# Altium project Common_Sensor_Box.PrjPCB (part 16 of 17)

## Sheet Sensor_LoRa_Flower_Watchdog.SchDoc: Title
size 420 x 297 mm; Author: G.Kasprowicz; CompanyName: WUT ISE; DrawnBy: G.Kasprowicz; Organization: WUT ISE; Address1: PW ISE; Address2: Nowowiejska 15/19 00-665 Warsaw; Address3: gkasprow@gmail.com; Revision: 1.0; SheetNumber: -; SheetTotal: -; ModifiedBy: -; CheckedDate: -; Title2: Title2; DivGrp: WUT ISE; Designer: G.Kasprowicz; ModifiedDate: -; ProjectName: Sensor Box
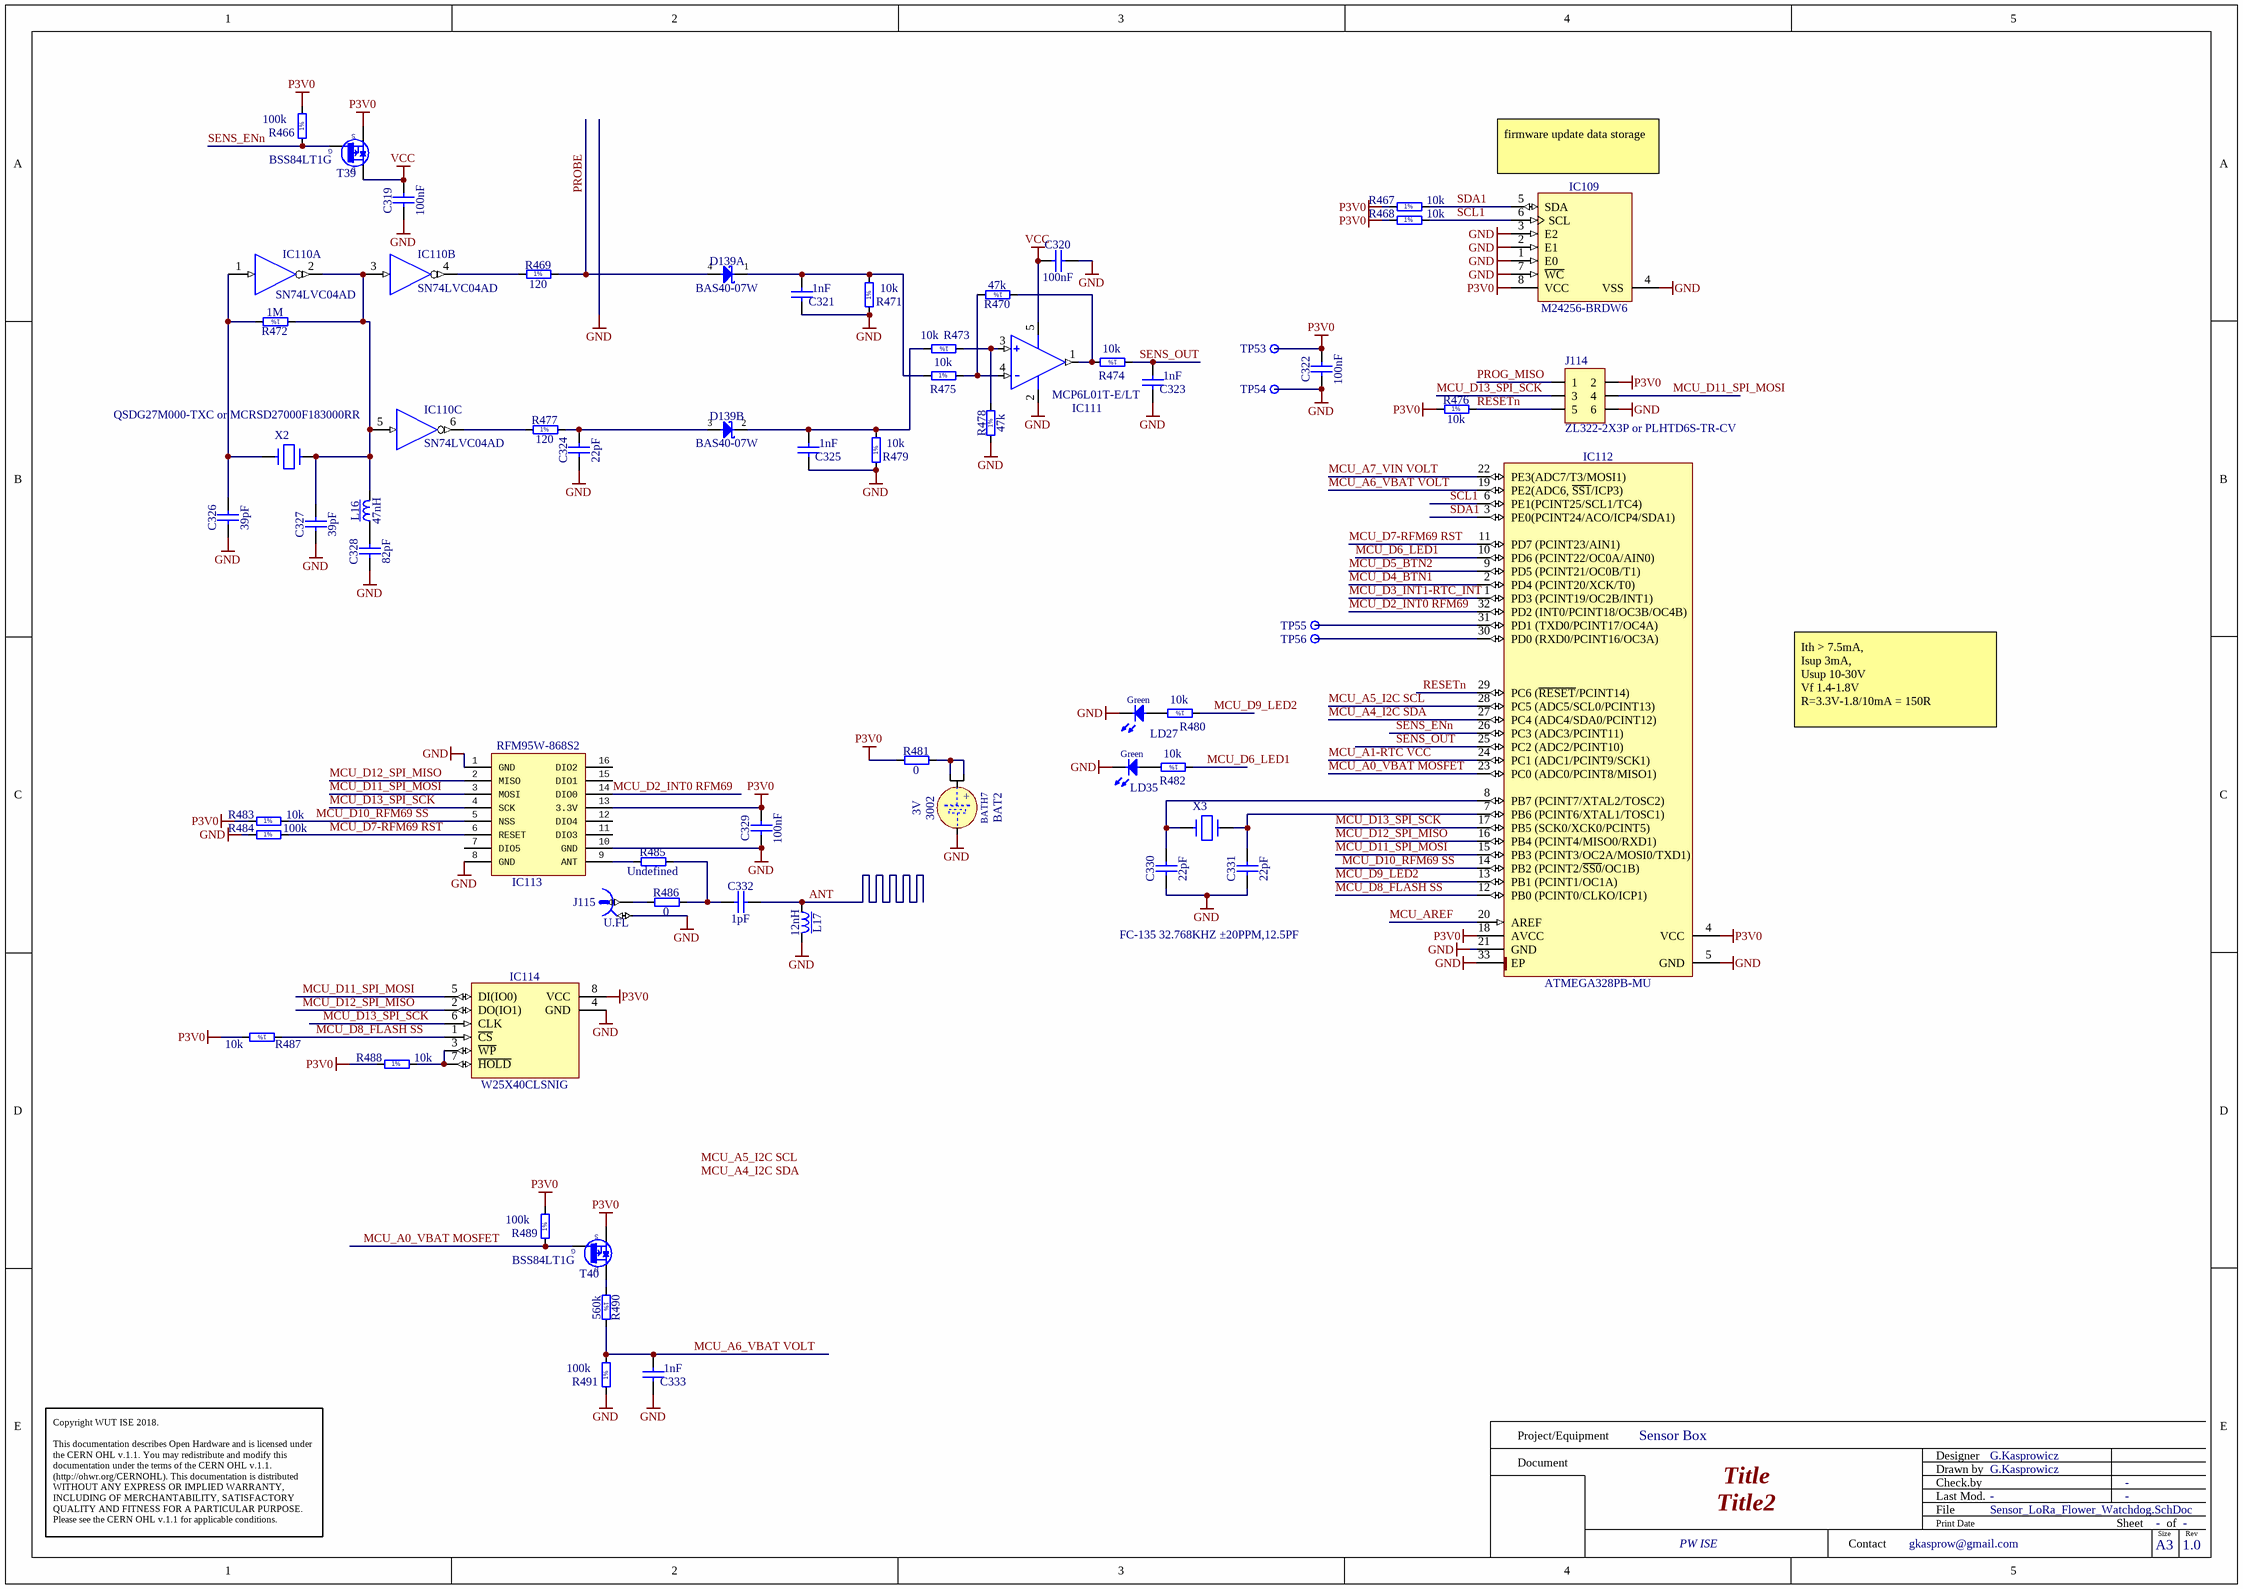
[diagram p22: Sensor_LoRa_Flower_Watchdog.SchDoc]

### Parts
(Parts that share a designator on the sheet are numbered #1, #2 ... from top to bottom, then left to right.)
BAT2  3V  [BAT_VARTA_CR2032]
BATH7  3002  [KEYSTONE 3002]
C319  100nF  [CAPC1005X55N]
C320  100nF  [CAPC1005X55N]
C321  1nF  [CAPC1005X55N]
C322  100nF  [CAPC1005X55N]
C323  1nF  [CAPC1005X55N]
C324  22pF  [CAPC1005X55N]
C325  1nF  [CAPC1005X55N]
C326  39pF  [CAPC1608X87N]
C327  39pF  [CAPC1608X87N]
C328  82pF  [CAPC2012X90N]
C329  100nF  [CAPC1005X55N]
C330  22pF  [CAPC1005X55N]
C331  22pF  [CAPC1005X55N]
C332  1pF  [CAPC1005X55N]
C333  1nF  [CAPC1005X55N]
D139  BAS40-07W  [INFINEON-PG-SOT343-4]  (parts A,B of 2)
IC109  M24256-BRDW6  [SOP65P640X120-8N]
IC110  SN74LVC04AD  [SOIC127P600X175-14N]  (parts A,B,C of 6)
IC111  MCP6L01T-E/LT  [SC70]
IC112  ATMEGA328PB-MU  [QFN50P500X500X100-33N-S325]
IC113  RFM95W-868S2  [RFM95W]
IC114  W25X40CLSNIG  [SOIC127P600X135-8N]
J114  ZL322-2X3P or PLHTD6S-TR-CV  [ZL322-2X3P]
J115  U.FL  [HIROSE_U.FL-R-SMT-1(10)]
L16  47nH  [IND_COILCRAFT_0805CS]
L17  12nH  [IND_COILCRAFT_0603HP]
LD27  Green  [LED_KINGBRIGHT_KPH-1608CGCK]
LD35  Green  [LED_KINGBRIGHT_KPH-1608CGCK]
R466  100k  [RESC1005X40N]
R467  10k  [RESC1005X40N]
R468  10k  [RESC1005X40N]
R469  120  [RESC1005X40N]
R470  47k  [RESC1005X40N]
R471  10k  [RESC1005X40N]
R472  1M  [RESC1005X40N]
R473  10k  [RESC1005X40N]
R474  10k  [RESC1005X40N]
R475  10k  [RESC1005X40N]
R476  10k  [RESC1005X40N]
R477  120  [RESC1005X40N]
R478  47k  [RESC1005X40N]
R479  10k  [RESC1005X40N]
R480  10k  [RESC1005X40N]
R481  0  [RESC1608X55N]
R482  10k  [RESC1005X40N]
R483  10k  [RESC1005X40N]
R484  100k  [RESC1005X40N]
R485  Undefined  [RESC1608X55N]
R486  0  [RESC1608X55N]
R487  10k  [RESC1005X40N]
R488  10k  [RESC1005X40N]
R489  100k  [RESC1005X40N]
R490  560k  [RESC1005X40N]
R491  100k  [RESC1005X40N]
T39  BSS84LT1G  [SOT95P240X110-3N]
T40  BSS84LT1G  [SOT95P240X110-3N]
TP53  Test Point  [TPS127]  (value not drawn)
TP54  Test Point  [TPS127]  (value not drawn)
TP55  Test Point  [TPS127]  (value not drawn)
TP56  Test Point  [TPS127]  (value not drawn)
X2#2  QSDG27M000-TXC or MCRSD27000F183000RR  [HC-49SM]
X3#2  FC-135 32.768KHZ ±20PPM,12.5PF  [XTAL_FC135]

### Nets
GND: BATH7.2(MINUS) C319.1 C320.2 C321.1 C322.1 C323.1 C324.1 C325.1 C326.1 C327.1 C328.1 C329.1 C330.1 C331.1 C333.1 IC109.1(E0) IC109.2(E1) IC109.3(E2) IC109.4(VSS) IC109.7(~{WC}) IC110.7(GND) IC111.2(V-) IC112.5(GND) IC112.21(GND) IC112.33(EP) IC113.1(GND) IC113.8(GND) IC113.10(GND) IC114.4(GND) J114.6 J115.2 L17.2 LD27.1(C) LD35.1(C) R471.1 R478.1 R479.1 R484.1 R491.1 TP54.1
P3V0: C322.2 C329.2 IC109.8(VCC) IC112.4(VCC) IC112.18(AVCC) IC113.13(3.3V) IC114.8(VCC) J114.2 R466.2 R467.1 R468.1 R476.1 R481.1 R483.1 R487.2 R488.1 R489.2 T39.2(S) T40.2(S) TP53.1
VCC: C319.2 C320.1 IC110.14(VCC) IC111.5(V+) T39.3(D)
ANT: C332.2 L17.1
MCU_A0_VBAT MOSFET: IC112.23(PC0_(ADC0/PCINT8/MISO1)) R489.1 T40.1(G)
MCU_A1-RTC VCC: IC112.24(PC1_(ADC1/PCINT9/SCK1))
MCU_A4_I2C SDA: IC112.27(PC4_(ADC4/SDA0/PCINT12))
MCU_A5_I2C SCL: IC112.28(PC5_(ADC5/SCL0/PCINT13))
MCU_A6_VBAT VOLT: C333.2 IC112.19(PE2(ADC6,_~{SS1}/ICP3)) R490.2 R491.2
MCU_A7_VIN VOLT: IC112.22(PE3(ADC7/T3/MOSI1))
MCU_AREF: IC112.20(AREF)
MCU_D2_INT0 RFM69: IC112.32(PD2_(INT0/PCINT18/OC3B/OC4B)) IC113.14(DIO0)
MCU_D3_INT1-RTC_INT: IC112.1(PD3_(PCINT19/OC2B/INT1))
MCU_D4_BTN1: IC112.2(PD4_(PCINT20/XCK/T0))
MCU_D5_BTN2: IC112.9(PD5_(PCINT21/OC0B/T1))
MCU_D6_LED1: IC112.10(PD6_(PCINT22/OC0A/AIN0)) R482.1
MCU_D7-RFM69 RST: IC112.11(PD7_(PCINT23/AIN1)) IC113.6(RESET) R484.2
MCU_D8_FLASH SS: IC112.12(PB0_(PCINT0/CLKO/ICP1)) IC114.1(~{CS}) R487.1
MCU_D9_LED2: IC112.13(PB1_(PCINT1/OC1A)) R480.1
MCU_D10_RFM69 SS: IC112.14(PB2_(PCINT2/~{SS0}/OC1B)) IC113.5(NSS) R483.2
MCU_D11_SPI_MOSI: IC112.15(PB3_(PCINT3/OC2A/MOSI0/TXD1)) IC113.3(MOSI) IC114.5(DI(IO0)) J114.4
MCU_D12_SPI_MISO: IC112.16(PB4_(PCINT4/MISO0/RXD1)) IC113.2(MISO) IC114.2(DO(IO1))
MCU_D13_SPI_SCK: IC112.17(PB5_(SCK0/XCK0/PCINT5)) IC113.4(SCK) IC114.6(CLK) J114.3
PROBE: D139.4(A) R469.2
PROG_MISO: J114.1
RESETn: IC112.29(PC6_(~{RESET}/PCINT14)) J114.5 R476.2
SCL1: IC109.6(SCL) IC112.6(PE1(PCINT25/SCL1/TC4)) R468.2
SDA1: IC109.5(SDA) IC112.3(PE0(PCINT24/ACO/ICP4/SDA1)) R467.2
SENS_ENn: IC112.26(PC3_(ADC3/PCINT11)) R466.1 T39.1(G)
SENS_OUT: C323.2 IC112.25(PC2_(ADC2/PCINT10)) R474.1
NetBATH7_1a: BATH7.1a(PLUS) BATH7.1b(PLUS) R481.2
NetC321_2: C321.2 D139.1(C) R471.2 R475.1
NetC324_2: C324.2 D139.3(C) R477.2
NetC325_2: C325.2 D139.2(A) R473.2 R479.2
NetC326_2: C326.2 IC110.1(A) R472.2 X2#2.1
NetC327_2: C327.2 IC110.2(~{O}) IC110.3(A) IC110.5(A) L16.2 R472.1 X2#2.2
NetC328_2: C328.2 L16.1
NetC330_2: C330.2 IC112.8(PB7_(PCINT7/XTAL2/TOSC2)) X3#2.1
NetC331_2: C331.2 IC112.7(PB6_(PCINT6/XTAL1/TOSC1)) X3#2.2
NetC332_1: C332.1 R485.2 R486.2
NetIC110_4: IC110.4(~{O}) R469.1
NetIC110_6: IC110.6(~{O}) R477.1
NetIC111_1: IC111.1(OUT) R470.1 R474.2
NetIC111_3: IC111.3(IN+) R473.1 R478.2
NetIC111_4: IC111.4(in-) R470.2 R475.2
NetIC112_30: IC112.30(PD0_(RXD0/PCINT16/OC3A)) TP56.1
NetIC112_31: IC112.31(PD1_(TXD0/PCINT17/OC4A)) TP55.1
NetIC113_9: IC113.9(ANT) R485.1
NetIC114_3: IC114.3(~{WP}) IC114.7(~{HOLD}) R488.2
NetJ115_1: J115.1 R486.1
NetLD27_2: LD27.2(A) R480.2
NetLD35_2: LD35.2(A) R482.2
NetR490_1: R490.1 T40.3(D)

Not connected (* = marked no-connect by the designer): IC113 7(DIO5) 11(DIO3) 12(DIO4) 15(DIO1) 16(DIO2)

### Notes on the sheet
- (near IC109) firmware update data storage
- Ith > 7.5mA,
  Isup 3mA,
  Usup 10-30V
  Vf 1.4-1.8V
  R=3.3V-1.8/10mA = 150R
- Labels drawn without touching a wire or pin: MCU_A4_I2C SDA, MCU_A5_I2C SCL
- Project/Equipment
- Document
- Designer
- Drawn by
- Check.by
- Copyright WUT ISE 2018.
  This documentation describes Open Hardware and is licensed under the CERN OHL v.1.1. You may redistribute and modify this documentation under the terms of the CERN OHL v.1.1. (http://ohwr.org/CERNOHL). This documentation is distributed WITHOUT ANY EXPRESS OR IMPLIED WARRANTY, INCLUDING OF MERCHANTABILITY, SATISFACTORY QUALITY AND FITNESS FOR A PARTICULAR PURPOSE. Please see the CERN OHL v.1.1 for applicable conditions.
- Contact
- File
- Last Mod.
- Print Date
- Sheet
- Size
- A3
- of
- Rev
- (in symbol BAT_VARTA_CR2032) +
- (in symbol BATTERY_HOLD_CR2032_SMD) +
- (in symbol R0402_1M_1%_0.0625W_100PPM) 1%
- (in symbol R0402_10K_1%_0.0625W_100PPM) 1%
- (in symbol R0402_47K_1%_0.0625W_100PPM) 1%
- (in symbol R0402_100K_1%_0.0625W_100PPM) 1%
- (in symbol R0402_120R_1%_0.0625W_100PPM) 1%
- (in symbol R0402_560K_1%_0.0625W_100PPM) 1%

### Library data of the parts
BAT2 = BAT_VARTA_CR2032: Battery for use only with Socket Holder; Part Description: 20x3.2mm Lithium Coin Cells Type CR2032; Manufacturer: VARTA; Manufacturer Part Number: 6032101501; PressFit: No; Power: 230mAh; Part Number: BAT_VARTA_CR2032; Component Kind: Standard; Component Type: Standard; Pin Count: 0; PackageDescription: CR2032, 20mm Diameter x 3.2mm  Height Lithium Coin Cells; Family: Battery; Mounted: Yes; Socket: Yes; SMD: No; Sense: No; Value: 3V; ComponentHeight: 3.2mm; HelpURL: \\cern.ch\dfs\Applications\Altium\Datasheets\BAT_VARTA_CR2032.pdf; Author: CERN DEM JLC; CreateDate: 20/10/2009; LatestRevisionDate: 20/10/2009
BATH7 = BATTERY_HOLD_CR2032_SMD: Battery Holder Keystone 3002; Part Number: BATH_KEYSTONE_3000; Part Description: KEYSTONE 3002 CR2032 BATTERY HOLDER; PressFit: No; Component Kind: Standard; Component Type: Standard; Pin Count: 3; PackageDescription: KEYSTONE 3002 CR2032 BATTERY HOLDER; Family: Battery; Mounted: Yes; Socket: No; SMD: Yes; Sense: No; Manufacturer: KEYSTONE; Manufacturer Part Number: 3002; ComponentHeight: 3.17mm; HelpURL: \\cern.ch\dfs\Applications\Altium\Datasheets\BATH_KEYSTONE_3000.pdf; Author: GK; CreateDate: 17/04/2012; LatestRevisionDate: 07/06/2017
C319 C320 C322 C329 = CC0402_100NF_16V_10%_X5R: as C16#3 on sheet Sensor_Box_Water_Meter_Valve; Part Number: CC0402_100NF_16V_10%_X5R; Component Kind: Standard; Component Type: Standard; Pin Count: 2; Value: 100nF; Status: None; Manufacturer Part Number: CC0402_100NF_16V_10%_X5R; Case: 0402; Mounted: Yes; Socket: No; SMD: Yes; Sense: No; Manufacturer1 Example: MURATA; Manufacturer1 ComponentHeight: 0.55mm; HelpURL: \\cern.ch\dfs\Applications\Altium\Datasheets\CC0402_X5R_MURATA_GRM.pdf; Author: CERN DEM JLC; CreateDate: 10.12.2013; LatestRevisionDate: 10.12.2013
C321 C323 C325 C333 = CC0402_1NF_50V_10%_X7R: Non-polarised capacitor; Part Description: SMD Multilayer Chip Ceramic Capacitor; Manufacturer: GENERIC; Manufacturer1 Part Number: 223858715623; Voltage: 50V; TC: X7R; Tolerance: ±10%; Part Number: CC0402_1NF_50V_10%_X7R; Component Kind: Standard; Component Type: Standard; Pin Count: 2; Value: 1nF; Status: Not Recommended; Manufacturer Part Number: CC0402_1NF_50V_10%_X7R; Case: 0402; Mounted: Yes; Socket: No; SMD: Yes; Sense: No; Manufacturer1 Example: PHYCOMP; Manufacturer1 ComponentHeight: 0.55mm; HelpURL: \\cern.ch\dfs\Applications\Altium\Datasheets\CC0402_X7R_PHYCOMP.pdf; Author: CERN DEM JLC; CreateDate: 03/12/2007; LatestRevisionDate: 03/12/2007
C324 C330 C331 = CC0402_22PF_50V_5%_C0G: Non-polarised capacitor; Part Description: SMD Multilayer Chip Ceramic Capacitor; Manufacturer: GENERIC; Manufacturer1 Part Number: C0402C220J5GACTU; Voltage: 50V; TC: C0G/NP0; Tolerance: ±5%; Part Number: CC0402_22PF_50V_5%_C0G; Component Kind: Standard; Component Type: Standard; Pin Count: 2; Value: 22pF; Status: Preferred; Manufacturer Part Number: CC0402_22PF_50V_5%_C0G; Case: 0402; Mounted: Yes; Socket: No; SMD: Yes; Sense: No; Manufacturer1 Example: KEMET; Manufacturer1 ComponentHeight: 0.55mm; HelpURL: \\cern.ch\dfs\Applications\Altium\Datasheets\CC0805_C0G_KEMET_(Commercial Grade).pdf; Author: CERN DEM JLC; CreateDate: 03/12/2007; LatestRevisionDate: 03/12/2007
C326 C327 = CC0603_39PF_50V_5%_NP0: Non-polarised capacitor; Part Description: SMD Multilayer Chip Ceramic Capacitor; Manufacturer: GENERIC; Manufacturer1 Part Number: 223886715399; Voltage: 50V; TC: C0G/NP0; Tolerance: ±5%; Part Number: CC0603_39PF_50V_5%_NP0; Component Kind: Standard; Component Type: Standard; Pin Count: 2; Value: 39pF; Status: Preferred; Manufacturer Part Number: CC0603_39PF_50V_5%_NP0; Case: 0603; Mounted: Yes; Socket: No; SMD: Yes; Sense: No; Manufacturer1 Example: PHYCOMP; Manufacturer1 ComponentHeight: 0.87mm; HelpURL: \\cern.ch\dfs\Applications\Altium\Datasheets\CC0603_NP0_PHYCOMP.pdf; Author: CERN DEM JLC; CreateDate: 03/12/2007; LatestRevisionDate: 03/12/2007
C328 = CC0805_82PF_100V_1%_NP0_AVX_08051A820FAT2A: Non-polarised capacitor; Part Description: SMD Multilayer Chip Ceramic Capacitor; Manufacturer: AVX; Voltage: 100V; TC: NP0; Tolerance: ±1%; Part Number: CC0805_82PF_100V_1%_NP0_AVX_08051A820FAT2A; Component Kind: Standard; Component Type: Standard; Pin Count: 2; Value: 82pF; Status: Not Recommended; Manufacturer Part Number: 08051A820FAT2A; Case: 0805; Mounted: Yes; Socket: No; SMD: Yes; Sense: No; ComponentHeight: 0.9mm; HelpURL: \\cern.ch\dfs\Applications\Altium\Datasheets\CC0805_C0G_AVX.pdf; Author: CERN DEM WB; CreateDate: 26/07/2016; LatestRevisionDate: 26/07/2016
C332 = CC0402_1PF_50V_0.25PF_C0G: Non-polarised capacitor; Part Description: SMD Multilayer Chip Ceramic Capacitor; Manufacturer: GENERIC; Manufacturer1 Part Number: C0402C109C5GACTU; Voltage: 50V; TC: C0G/NP0; Tolerance: ±0.25pF; Part Number: CC0402_1PF_50V_0.25PF_C0G; Component Kind: Standard; Component Type: Standard; Pin Count: 2; Value: 1pF; Status: Preferred; Manufacturer Part Number: CC0402_1PF_50V_0.25PF_C0G; Case: 0402; Mounted: Yes; Socket: No; SMD: Yes; Sense: No; Manufacturer1 Example: KEMET; Manufacturer1 ComponentHeight: 0.55mm; HelpURL: \\cern.ch\dfs\Applications\Altium\Datasheets\CC0805_C0G_KEMET_(Commercial Grade).pdf; Author: CERN DEM JLC; CreateDate: 03/12/2007; LatestRevisionDate: 22/04/2015
D139 = D_BAS40-07W: Anti-Parallel Pair Schottky Diode; Part Number: BAT15099E6327HTSA1; Manufacturer: INFINEON; Voltage: 4V; Power: 120mA; PressFit: No; Bonding: No; Component Kind: Standard; Component Type: Standard; Device: BAS40-07W; PackageDescription: INFINEON PG-SOT343-4, SOT343, 1.30mm Pitch; 4 Pin,1.25mm W X 2.00mm L X 1.10mm H body, IPC Medium Density; Part Description: Anti-Parallel Pair Schottky Diode; Manufacturer Part Number: BAS40-07W; Pin Count: 4; Case: SOT343; Mounted: Yes; Socket: No; SMD: Yes; Sense: No; ComponentHeight: 1.1mm; HelpURL: \\cern.ch\dfs\Applications\Altium\Datasheets\BAT15099E6327HTSA1.pdf; Author: GK; CreateDate: 28/03/2018; LatestRevisionDate: 28/03/2018
IC109 = MEM_M24256-BRDW6P: as IC27 on sheet Sensor_Box_Water_Meter_Valve; Part Number: M24256-BRDW6P; Component Kind: Standard; Component Type: Standard; Device: M24256-BRDW6; PackageDescription: SOP, 0.65mm pitch; 8 pin, 4.40mm W X 3.00mm L X 1.20mm H body, IPC Medium Density; Part Description: 256-Kbit Serial I²C Bus EEPROM; Manufacturer Part Number: M24256-BRDW6; Pin Count: 8; Case: TSSOP8; Mounted: Yes; Socket: No; SMD: Yes; Sense: No; ComponentHeight: 1.2mm; HelpURL: \\cern.ch\dfs\Applications\Altium\Datasheets\M24256-BRDW6P.pdf; Author: CERN DEM MR; CreateDate: 17.03.2016; LatestRevisionDate: 17.03.2016
IC110 = SN74LVC04AD: Hex Inverter; Part Description: Hex Inverters; Manufacturer: TEXAS INSTRUMENTS; PressFit: No; Bonding: No; Part Number: SN74LVC04AD; Component Kind: Standard; Component Type: Standard; Device: SN74LVC04AD; PackageDescription: SOIC 14, Pitch 1.27mm - Body 4x8.75mm, IPC Medium Density; Manufacturer Part Number: SN74LVC04AD; Pin Count: 12; Case: SOIC14; Mounted: Yes; Socket: No; SMD: Yes; Sense: No; ComponentHeight: 1.75mm; Author: CERN DEM JLC; HelpURL: \\cern.ch\dfs\Applications\Altium\Datasheets\SN74LVC04AD.pdf; CreateDate: 21/06/2011; LatestRevisionDate: 21/06/2011
IC111 = OA_MCP6001_SC-70: 1 MHz, Low-Power Op Amp
IC112 = UPC_ATMEGA328PB-MU: as IC106 on sheet Sensor_Box_Water_Meter_Valve; Part Number: ATMEGA328PB-MU; Component Kind: Standard; Component Type: Standard; Device: ATMEGA328PB-MU; PackageDescription: QFN, (MO-220-VHHD-2) 0.50mm pitch,square; 8 pin X 8 pin, 5mm X 5mm X 1.00mm H body (w/thermal tab 3.25 X 3.25mm),  IPC Medium Density; Manufacturer Part Number: ATMEGA328PB-MU; Pin Count: 33; Case: QFN32; Mounted: Yes; Socket: No; SMD: Yes; Sense: No; ComponentHeight: 1mm; HelpURL: \\cern.ch\dfs\Applications\Altium\Datasheets\ATMEGA328P-MU.pdf; Author: GK; CreateDate: 2011-02-08; LatestRevisionDate: 2014-07-02
IC113 = RF_RFM95W: Low Power LoRa Transceiver Module; Part Description: DC-3GHz Monolithic Amplifier; Manufacturer: HOPE MICROELECTRONICS; PressFit: No; Bonding: No; Part Number: RFM95W-868S2; Component Kind: Standard; Component Type: Standard; Device: RFM95W-868S2; PackageDescription: castellated module; Manufacturer Part Number: RFM95W-868S2; Pin Count: 16; Mounted: Yes; Socket: No; SMD: Yes; Sense: No; ComponentHeight: 1.52mm; Author: GK; HelpURL: \\cern.ch\dfs\Applications\Altium\Datasheets\ERA-4XSM+.pdf; CreateDate: 11.08.2016; LatestRevisionDate: 11.08.2016
IC114 = MEM_W25X40CLSNIG: 4M-bit Serial Flash Memory with uniform 4KB sectors and Dual SPI and QPI; Manufacturer: WINBOND; PressFit: No; Bonding: No; Part Number: W25X40CLSNIG; Component Kind: Standard; Component Type: Standard; Device: W25X40CLSNIG; PackageDescription: SOIC, 8-Leads, Body 4.90x3.90mm, Pitch 1.27mm, IPC Medium Density; Part Description: 4M-bit Serial Flash Memory with uniform 4KB sectors and Dual SPI; Manufacturer Part Number: W25X40CLSNIG; Pin Count: 8; Case: SOIC8; Mounted: Yes; Socket: No; SMD: Yes; Sense: No; ComponentHeight: 2.16mm; HelpURL: \\cern.ch\dfs\Applications\Altium\Datasheets\W25Q128FVSIG.pdf; Author: GK; CreateDate: 26/01/2018; LatestRevisionDate: 26/01/2018
J114 = CON_2x3 1.27 SMT Male: 1.27 mm dual row goldpin (Maritex)
J115 = HIROSE_U.FL-R-SMT-1(10): Part Description: Up to 6GHz Ultra Small Surface Mount Male Coaxial Connectors U.FL Series; Manufacturer: HIROSE (HRS); PressFit: No; Part Number: HIROSE_U.FL-R-SMT-1(10); Component Kind: Standard; Component Type: Standard; Pin Count: 2; Family: U.FL; Mounted: Yes; Socket: No; SMD: Yes; Sense: No; Status: None; Manufacturer Part Number: U.FL-R-SMT-1(10); ComponentHeight: 1.25mm; HelpURL: \\cern.ch\dfs\Applications\Altium\Datasheets\HIROSE_U.FL-R-SMT-1(10).pdf; Author: CERN DEM JLC; CreateDate: 24/03/2010; LatestRevisionDate: 24/03/2010
L16 = IND_47NH_2%_COILCRAFT_0805CS: Inductor With Core; Part Description: SMT Chip Inductor; Manufacturer Part Number: 0805CS-470XGLC; Power: 500mA; Resistance: 0.31R; Tolerance: ±2%; Part Number: IND_47NH_2%_COILCRAFT_0805CS; Component Kind: Standard; Component Type: Standard; Pin Count: 2; Value: 47nH; Status: None; Manufacturer: COILCRAFT; Case: 0805; Mounted: Yes; Socket: No; SMD: Yes; Sense: No; ComponentHeight: 1.52mm; HelpURL: \\cern.ch\dfs\Applications\Altium\Datasheets\IND_COILCRAFT_0805CS.pdf; Author: CERN DEM JLC; CreateDate: 19/08/2013; LatestRevisionDate: 20/08/2013
L17 = L_0603_12NH_2%: Inductor; Part Number: IND0603_12NH_2%_LQW18AN12NG00D; Part Description: Ceramic Chip Inductor; Manufacturer: Murata; Manufacturer Part Number: LQW18AN12NG00D; Power: 0.6A; Resistance: 0.13R; Tolerance: ±2%; Component Kind: Standard; Component Type: Standard; Pin Count: 2; Value: 12nH; Status: None; Case: 0603; Mounted: Yes; Socket: No; SMD: Yes; Sense: No; ComponentHeight: 0.94mm; HelpURL: \\cern.ch\dfs\Applications\Altium\Datasheets\IND0603_COILCRAFT_0603HP.pdf; Author: GK; CreateDate: 09/02/2017; LatestRevisionDate: 09/02/2017
LD27 LD35 = LED_KINGBRIGHT_KPH-1608CGCK: as LD34 on sheet Sensor_Box_Water_Meter_Valve; Part Number: LED_KINGBRIGHT_KPH-1608CGCK; Component Kind: Standard; Component Type: Standard; Color: Green; PackageDescription: SMT Green LED, Case 0603, Body L 1.6 x W 0.8mm H 0.65mm; Manufacturer: KINGBRIGHT; Manufacturer Part Number: KPH-1608CGCK; Pin Count: 2; Mounted: Yes; Socket: No; SMD: Yes; Sense: No; ComponentHeight: 0.65mm; HelpURL: \\cern.ch\dfs\Applications\Altium\Datasheets\LED_KINGBRIGHT_KPH-1608CGCK.pdf; Author: CERN DEM JLC; CreateDate: 03.07.2017; LatestRevisionDate: 03.07.2017
R466 R484 R489 R491 = R0402_100K_1%_0.0625W_100PPM: as R17#3 on sheet Sensor_Box_Water_Meter_Valve; Part Number: R0402_100K_1%_0.0625W_100PPM; Component Kind: Standard; Component Type: Standard; Pin Count: 2; Value: 100k; Status: Not Recommended; Power: 0.0625W; Tolerance: ±1%; Manufacturer Part Number: R0402_100K_1%_0.0625W_100PPM; Case: 0402; Mounted: Yes; Sense: No; Socket: No; SMD: Yes; Manufacturer1 Example: YAGEO PHYCOMP; Manufacturer1 ComponentHeight: 0.4mm; HelpURL: \\cern.ch\dfs\Applications\Altium\Datasheets\R0402_Phycomp_RC0402.pdf; Author: CERN DEM JLC; CreateDate: 03/12/2007; LatestRevisionDate: 17/10/2012
R467 R468 R471 R473-R476 R479 R480 R482 R483 R487 R488 = R0402_10K_1%_0.0625W_100PPM: as R116 on sheet Sensor_Box_Water_Meter_Valve; Part Number: R0402_10K_1%_0.0625W_100PPM; Component Kind: Standard; Component Type: Standard; Pin Count: 2; Value: 10k; Status: Not Recommended; Power: 0.0625W; Tolerance: ±1%; Manufacturer Part Number: R0402_10K_1%_0.0625W_100PPM; Case: 0402; Mounted: Yes; Sense: No; Socket: No; SMD: Yes; Manufacturer1 Example: YAGEO PHYCOMP; Manufacturer1 ComponentHeight: 0.4mm; HelpURL: \\cern.ch\dfs\Applications\Altium\Datasheets\R0402_Phycomp_RC0402.pdf; Author: CERN DEM JLC; CreateDate: 03.12.2007; LatestRevisionDate: 17.10.2012
R469 R477 = R0402_120R_1%_0.0625W_100PPM: Resistor - 1%; Part Description: General Purpose Thick Film Chip Resistor; Manufacturer: GENERIC; Manufacturer1 Part Number: 232270671201L; TC: ±100ppm/°C; PressFit: No; Part Number: R0402_120R_1%_0.0625W_100PPM; Component Kind: Standard; Component Type: Standard; Pin Count: 2; Value: 120; Status: Not Recommended; Power: 0.0625W; Tolerance: ±1%; Manufacturer Part Number: R0402_120R_1%_0.0625W_100PPM; Case: 0402; Mounted: Yes; Sense: No; Socket: No; SMD: Yes; Manufacturer1 Example: YAGEO PHYCOMP; Manufacturer1 ComponentHeight: 0.4mm; HelpURL: \\cern.ch\dfs\Applications\Altium\Datasheets\R0402_Phycomp_RC0402.pdf; Author: CERN DEM JLC; CreateDate: 03/12/2007; LatestRevisionDate: 17/10/2012
R470 R478 = R0402_47K_1%_0.0625W_100PPM: Resistor - 1%; Part Description: General Purpose Thick Film Chip Resistor; Manufacturer: GENERIC; Manufacturer1 Part Number: 232270675103L; TC: ±100ppm/°C; PressFit: No; Part Number: R0402_47K_1%_0.0625W_100PPM; Component Kind: Standard; Component Type: Standard; Pin Count: 2; Value: 47k; Status: Not Recommended; Power: 0.0625W; Tolerance: ±1%; Manufacturer Part Number: R0402_47K_1%_0.0625W_100PPM; Case: 0402; Mounted: Yes; Sense: No; Socket: No; SMD: Yes; Manufacturer1 Example: YAGEO PHYCOMP; Manufacturer1 ComponentHeight: 0.4mm; HelpURL: \\cern.ch\dfs\Applications\Altium\Datasheets\R0402_Phycomp_RC0402.pdf; Author: CERN DEM JLC; CreateDate: 03/12/2007; LatestRevisionDate: 17/10/2012
R472 = R0402_1M_1%_0.0625W_100PPM: Resistor - 1%; Part Description: General Purpose Thick Film Chip Resistor; Manufacturer: GENERIC; Manufacturer1 Part Number: 232270671005L; TC: ±100ppm/°C; PressFit: No; Part Number: R0402_1M_1%_0.0625W_100PPM; Component Kind: Standard; Component Type: Standard; Pin Count: 2; Value: 1M; Status: Not Recommended; Power: 0.0625W; Tolerance: ±1%; Manufacturer Part Number: R0402_1M_1%_0.0625W_100PPM; Case: 0402; Mounted: Yes; Sense: No; Socket: No; SMD: Yes; Manufacturer1 Example: YAGEO PHYCOMP; Manufacturer1 ComponentHeight: 0.4mm; HelpURL: \\cern.ch\dfs\Applications\Altium\Datasheets\R0402_Phycomp_RC0402.pdf; Author: CERN DEM JLC; CreateDate: 03/12/2007; LatestRevisionDate: 17/10/2012
R481 R486 = R0603_0R_JUMPER: Resistor; Part Description: 1A (0.05R Max DC Resistance) Zero Ohm Jumper; Manufacturer: GENERIC; Manufacturer1 Part Number: NRC06Z0; PressFit: No; Part Number: R0603_0R_JUMPER; Component Kind: Standard; Component Type: Standard; Pin Count: 2; Value: 0; Status: Preferred; Manufacturer Part Number: R0603_0R_JUMPER; Case: 0603; Mounted: Yes; Sense: No; Socket: No; SMD: Yes; Manufacturer1 Example: NIC COMPONENT; Manufacturer1 ComponentHeight: 0.55mm; HelpURL: \\cern.ch\dfs\Applications\Altium\Datasheets\R0603_NIC_NRC.pdf; Author: CERN DEM JLC; CreateDate: 03/12/2007; LatestRevisionDate: 13/03/2008
R485 = R0603_NO-VALUE: Resistor; Part Description: Reserved Footprint For a 0603 (1608) Chip Resistor; PressFit: No; Mounted: No; Part Number: R0603_NO-VALUE; Component Kind: Standard; Component Type: Standard; Pin Count: 2; Value: Undefined; Status: None; Manufacturer: Undefined; Manufacturer Part Number: R0603_NO-VALUE; Case: 0603; Sense: No; Socket: No; SMD: Yes; Manufacturer1 Example: Undefined; Manufacturer1 Part Number: Undefined; Manufacturer1 ComponentHeight: Undefined; HelpURL: Undefined; Author: CERN DEM JLC; CreateDate: 03/12/2007; LatestRevisionDate: 13/03/2008
R490 = R0402_560K_1%_0.0625W_100PPM: Resistor - 1%; Part Description: General Purpose Thick Film Chip Resistor; Manufacturer: GENERIC; Manufacturer1 Part Number: 232270675604L; TC: ±100ppm/°C; PressFit: No; Part Number: R0402_560K_1%_0.0625W_100PPM; Component Kind: Standard; Component Type: Standard; Pin Count: 2; Value: 560k; Status: Not Recommended; Power: 0.0625W; Tolerance: ±1%; Manufacturer Part Number: R0402_560K_1%_0.0625W_100PPM; Case: 0402; Mounted: Yes; Sense: No; Socket: No; SMD: Yes; Manufacturer1 Example: YAGEO PHYCOMP; Manufacturer1 ComponentHeight: 0.4mm; HelpURL: \\cern.ch\dfs\Applications\Altium\Datasheets\R0402_Phycomp_RC0402.pdf; Author: CERN DEM JLC; CreateDate: 03/12/2007; LatestRevisionDate: 17/10/2012
T39 T40 = BSS84LT1G: P-CHANNEL MOSFET WITH DIODE; Part Description: 50V 130mA Single P-Channel Power MOSFET; Manufacturer: ON SEMICONDUCTOR; PressFit: No; Bonding: No; Part Number: BSS84LT1G; Component Kind: Standard; Component Type: Standard; Device: BSS84LT1G; PackageDescription: SOT23 3-Leads, Pitch 0.95mm - Body 1.4x3mm, IPC Medium Density; Manufacturer Part Number: BSS84LT1G; Pin Count: 3; Case: SOT23-3; Mounted: Yes; Socket: No; SMD: Yes; Sense: No; ComponentHeight: 1.1mm; HelpURL: \\cern.ch\dfs\Applications\Altium\Datasheets\BSS84LT1G.pdf; Author: CERN DEM JLC; CreateDate: 29.03.2012; LatestRevisionDate: 29.03.2012
TP53-TP56 = SMD_PAD_1.27X1.27MM: Part Description: 1.27mm x 1.27mm PCB Copper Area (SMD Test Point); Mounted: No; Part Number: SMD_PAD_1.27X1.27MM; Component Kind: Standard (No BOM); Component Type: Standard (No BOM); Pin Count: 1; Family: Test Point; Socket: No; SMD: Yes; Sense: No; Status: None; ComponentHeight: 0mm; HelpURL: Undefined; Author: CERN DEM JLC; CreateDate: 12.01.2008; LatestRevisionDate: 12.01.2008; PackageDescription: 1.27mm x 1.27mm PCB Copper Area (SMD Test Point)
X2#2 = X_CRYSTAL_HC49_SMT_27M: Crystal oscillator; Supplier 1: Newark; Supplier Part Number 1: 56P2844
X3#2 = X_CRYSTAL_32k_FC-135: 32kHz SMT crystal (EPSON)

## Sheet Sensor_Box_LoRa.SchDoc: Title
size 420 x 297 mm; Author: G.Kasprowicz; CompanyName: WUT ISE; DrawnBy: G.Kasprowicz; Organization: WUT ISE; Address1: PW ISE; Address2: Nowowiejska 15/19 00-665 Warsaw; Address3: gkasprow@gmail.com; Revision: 1.0; SheetNumber: -; SheetTotal: -; ModifiedBy: -; CheckedDate: -; Title2: Title2; DivGrp: WUT ISE; Designer: G.Kasprowicz; ModifiedDate: -; ProjectName: Sensor Box
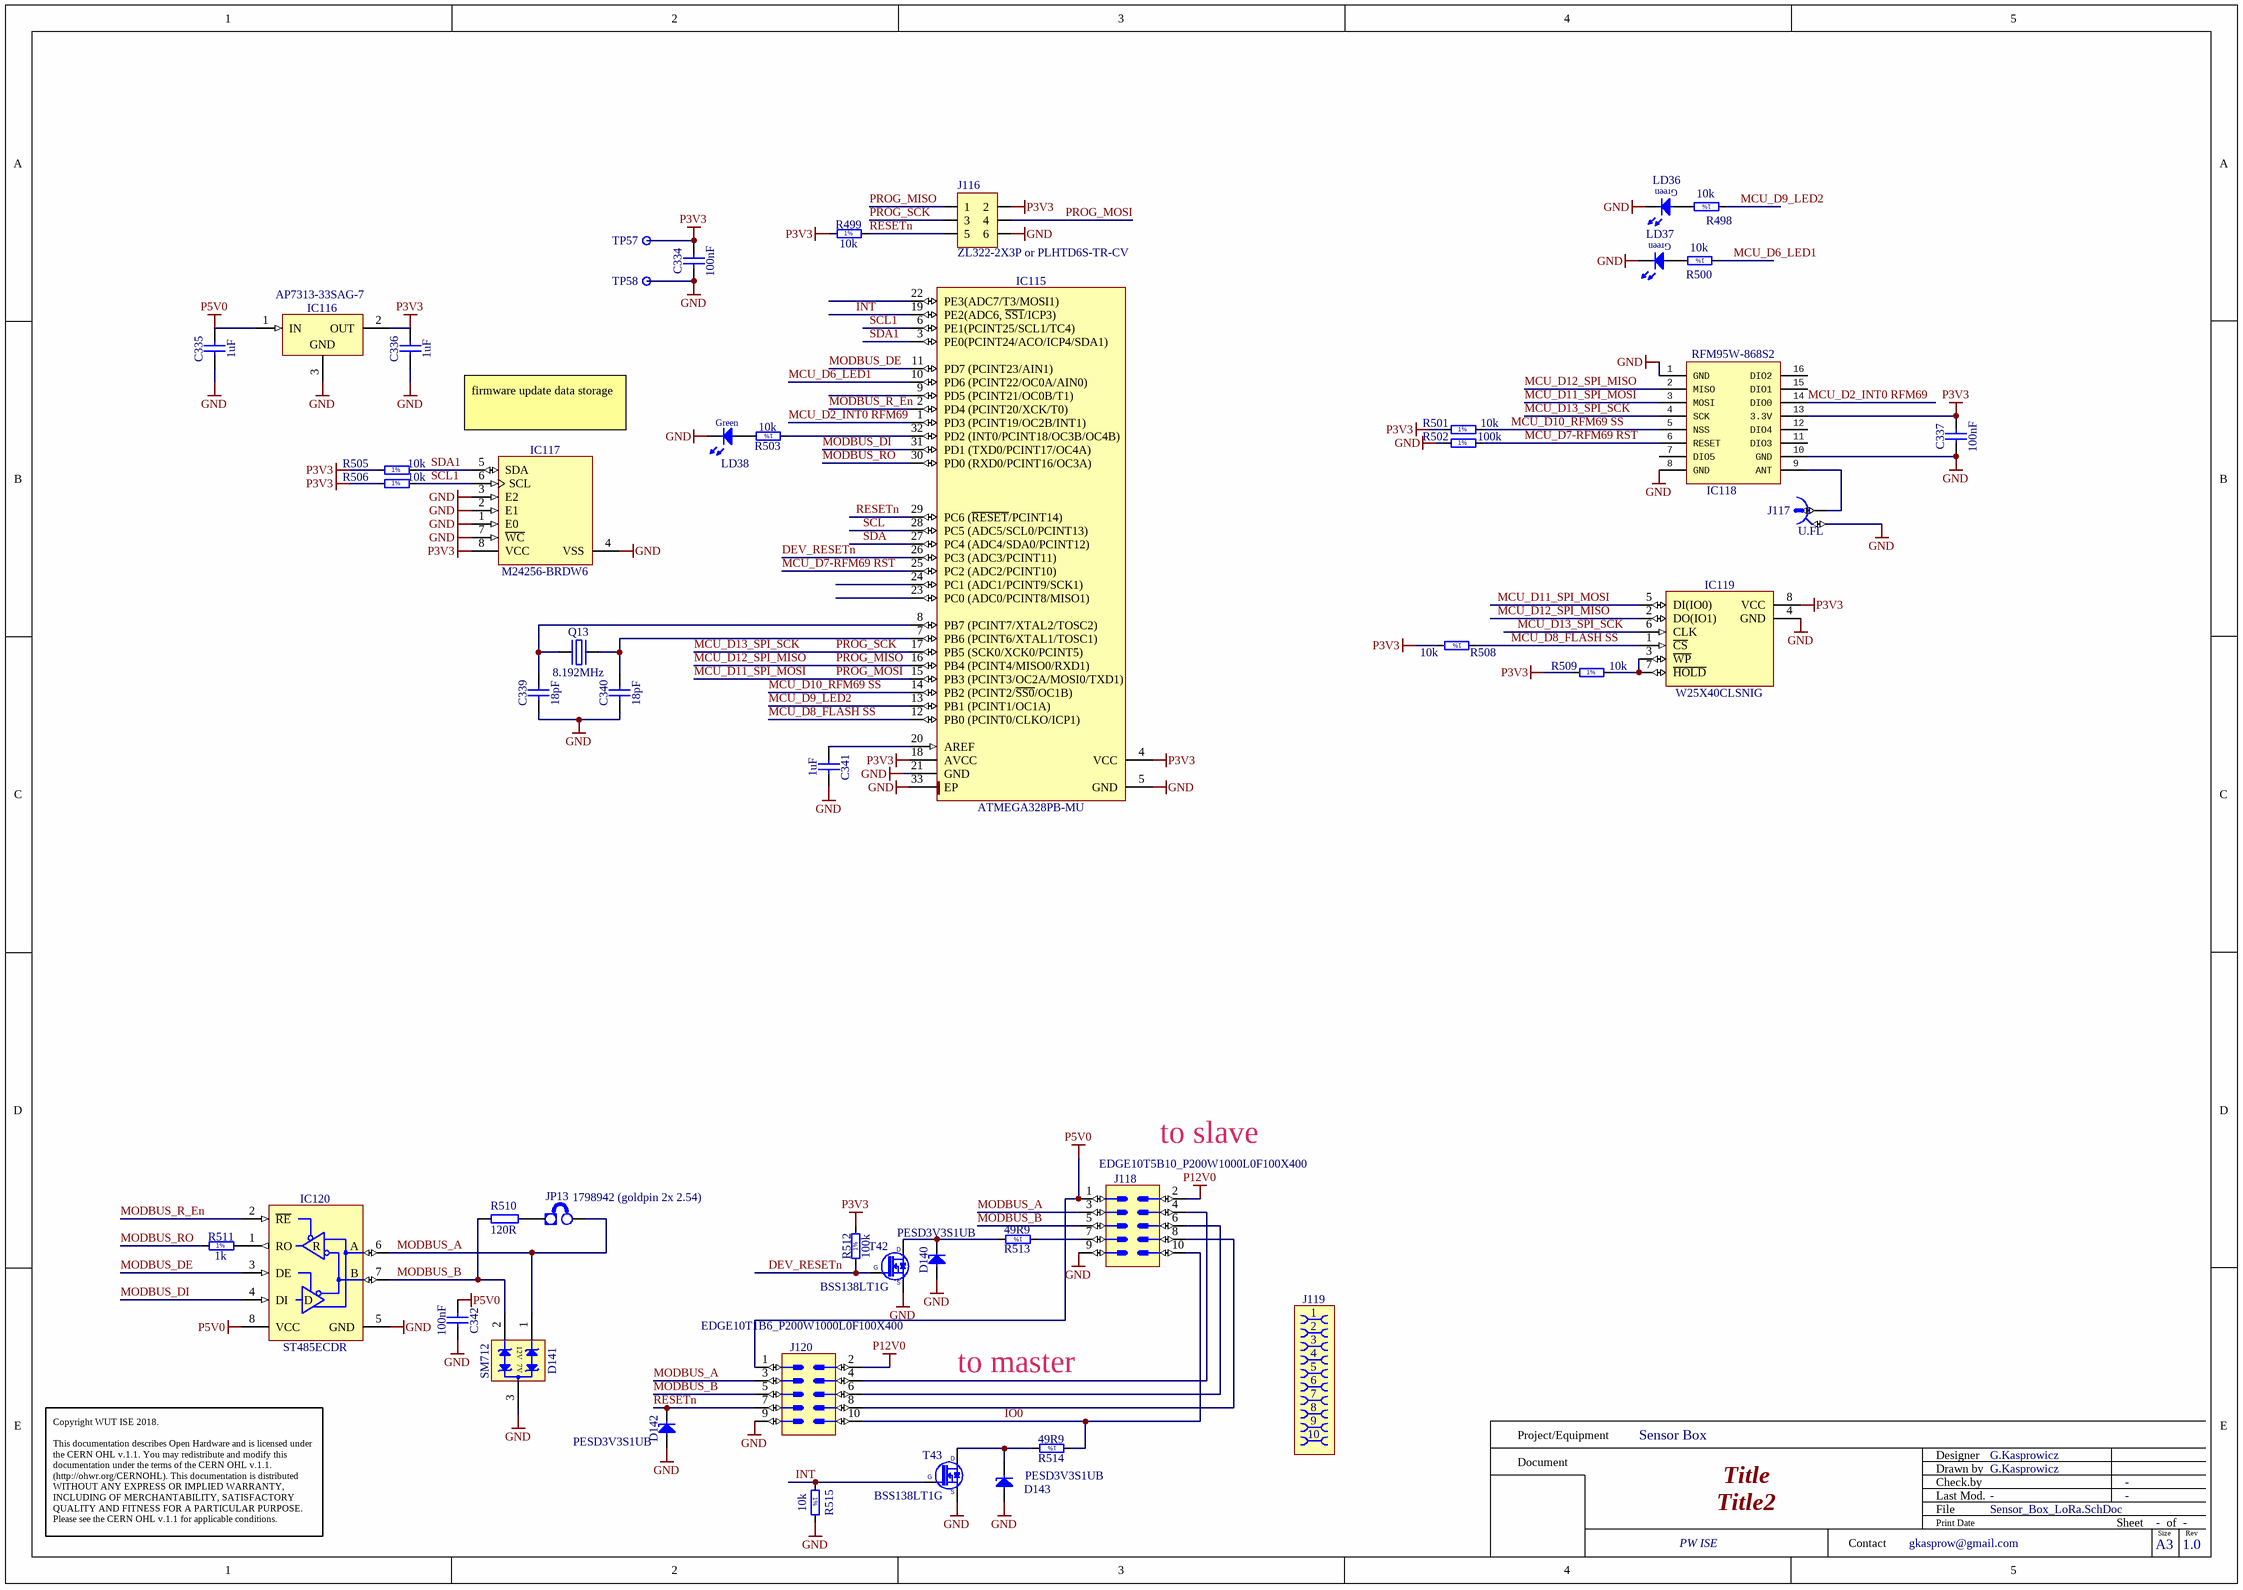
[diagram p23: Sensor_Box_LoRa.SchDoc]

### Parts
C334  100nF  [CAPC1005X55N]
C335  1uF  [CAPC1005X55N]
C336  1uF  [CAPC1005X55N]
C337  100nF  [CAPC1005X55N]
C339  18pF  [CAPC1005X55N]
C340  18pF  [CAPC1005X55N]
C341  1uF  [CAPC1005X55N]
C342  100nF  [CAPC1005X55N]
D140  PESD3V3S1UB  [SODFL1608X65N]
D141  SM712  [SOT95P237X112-3N]
D142  PESD3V3S1UB  [SODFL1608X65N]
D143  PESD3V3S1UB  [SODFL1608X65N]
IC115  ATMEGA328PB-MU  [QFN50P500X500X100-33N-S325]
IC116  AP7313-33SAG-7  [SOT95P240X130-3N]
IC117  M24256-BRDW6  [SOP65P640X120-8N]
IC118  RFM95W-868S2  [RFM95W]
IC119  W25X40CLSNIG  [SOIC127P600X135-8N]
IC120  ST485ECDR  [SOIC127P600X175-8N]
J116  ZL322-2X3P or PLHTD6S-TR-CV  [ZL322-2X3P]
J117  U.FL  [HIROSE_U.FL-R-SMT-1(10)]
J118  (no value)  [EDGE10T5B10_P200W1000L0F100X400]
J119  (no value)  [AVX_00 9159 010 061 916]
J120  (no value)  [EDGE10T1B6_P200W1000L0F100X400]
JP13  1798942 (goldpin 2x 2.54)  [jump]
LD36  Green  [LED_KINGBRIGHT_KPTR3216]  (value not drawn)
LD37  Green  [LED_KINGBRIGHT_KPTR3216]  (value not drawn)
LD38  Green  [LED_KINGBRIGHT_KPH-1608CGCK]
Q13  8.192MHz  [XTAL_ABRACON_ABLS]
R498  10k  [RESC1005X40N]
R499  10k  [RESC1005X40N]
R500  10k  [RESC1005X40N]
R501  10k  [RESC1005X40N]
R502  100k  [RESC1005X40N]
R503  10k  [RESC1005X40N]
R505  10k  [RESC1005X40N]
R506  10k  [RESC1005X40N]
R508  10k  [RESC1005X40N]
R509  10k  [RESC1005X40N]
R510  120R  [1206R]
R511  1k  [RESC1005X40N]
R512  100k  [RESC1005X40N]
R513  49R9  [RESC1005X40N]
R514  49R9  [RESC1005X40N]
R515  10k  [RESC1005X40N]
T42  BSS138LT1G  [SOT95P240X110-3N]
T43  BSS138LT1G  [SOT95P240X110-3N]
TP57  Test Point  [TPS127]  (value not drawn)
TP58  Test Point  [TPS127]  (value not drawn)

### Nets
GND: C334.1 C335.1 C336.1 C337.1 C339.1 C340.1 C341.2 C342.2 D140.2(A) D141.3(GND) D142.2(A) D143.2(A) IC115.5(GND) IC115.21(GND) IC115.33(EP) IC116.3(GND) IC117.1(E0) IC117.2(E1) IC117.3(E2) IC117.4(VSS) IC117.7(~{WC}) IC118.1(GND) IC118.8(GND) IC118.10(GND) IC119.4(GND) IC120.5(GND) J116.6 J117.2 J118.9 J120.9 LD36.1(C) LD37.1(C) LD38.1(C) R502.1 R515.2 T42.2(S) T43.2(S) TP58.1
P3V3: C334.2 C336.2 C337.2 IC115.4(VCC) IC115.18(AVCC) IC116.2(OUT) IC117.8(VCC) IC118.13(3.3V) IC119.8(VCC) J116.2 R499.1 R501.1 R505.1 R506.1 R508.2 R509.1 R512.2 TP57.1
P5V0: C335.2 C342.1 IC116.1(IN) IC120.8(VCC) J118.1 J120.1
P12V0: J118.2 J120.2
DEV_RESETn: IC115.26(PC3_(ADC3/PCINT11)) R512.1 T42.1(G)
INT: IC115.19(PE2(ADC6,_~{SS1}/ICP3)) R515.1 T43.1(G)
IO0: J118.10 J120.10 R514.1
MCU_D2_INT0 RFM69: IC115.1(PD3_(PCINT19/OC2B/INT1)) IC118.14(DIO0)
MCU_D6_LED1: IC115.10(PD6_(PCINT22/OC0A/AIN0)) R500.1
MCU_D7-RFM69 RST: IC115.25(PC2_(ADC2/PCINT10)) IC118.6(RESET) R502.2
MCU_D8_FLASH SS: IC115.12(PB0_(PCINT0/CLKO/ICP1)) IC119.1(~{CS}) R508.1
MCU_D9_LED2: IC115.13(PB1_(PCINT1/OC1A)) R498.1
MCU_D10_RFM69 SS: IC115.14(PB2_(PCINT2/~{SS0}/OC1B)) IC118.5(NSS) R501.2
MCU_D11_SPI_MOSI: IC115.15(PB3_(PCINT3/OC2A/MOSI0/TXD1)) IC118.3(MOSI) IC119.5(DI(IO0)) J116.4  [also labelled PROG_MOSI]
MCU_D12_SPI_MISO: IC115.16(PB4_(PCINT4/MISO0/RXD1)) IC118.2(MISO) IC119.2(DO(IO1)) J116.1  [also labelled PROG_MISO]
MCU_D13_SPI_SCK: IC115.17(PB5_(SCK0/XCK0/PCINT5)) IC118.4(SCK) IC119.6(CLK) J116.3  [also labelled PROG_SCK]
MODBUS_A: D141.1(I/O1) IC120.6(A) J118.3 J120.3 JP13.2(E2)
MODBUS_B: D141.2(I/O2) IC120.7(B) J118.5 J120.5 R510.1
MODBUS_DE: IC115.11(PD7_(PCINT23/AIN1)) IC120.3(DE)
MODBUS_DI: IC115.31(PD1_(TXD0/PCINT17/OC4A)) IC120.4(DI)
MODBUS_R_En: IC115.2(PD4_(PCINT20/XCK/T0)) IC120.2(~{RE})
MODBUS_RO: IC115.30(PD0_(RXD0/PCINT16/OC3A)) R511.1
RESETn: D142.1(C) IC115.29(PC6_(~{RESET}/PCINT14)) J116.5 J120.7 R499.2
SCL: IC115.28(PC5_(ADC5/SCL0/PCINT13))
SCL1: IC115.6(PE1(PCINT25/SCL1/TC4)) IC117.6(SCL) R506.2
SDA: IC115.27(PC4_(ADC4/SDA0/PCINT12))
SDA1: IC115.3(PE0(PCINT24/ACO/ICP4/SDA1)) IC117.5(SDA) R505.2
NetC339_2: C339.2 IC115.8(PB7_(PCINT7/XTAL2/TOSC2)) Q13.1(OSC1)
NetC340_2: C340.2 IC115.7(PB6_(PCINT6/XTAL1/TOSC1)) Q13.2(OSC2)
NetC341_1: C341.1 IC115.20(AREF)
NetD140_1: D140.1(C) R513.2 T42.3(D)
NetD143_1: D143.1(C) R514.2 T43.3(D)
NetIC115_32: IC115.32(PD2_(INT0/PCINT18/OC3B/OC4B)) R503.1
NetIC118_9: IC118.9(ANT) J117.1
NetIC119_3: IC119.3(~{WP}) IC119.7(~{HOLD}) R509.2
NetIC120_1: IC120.1(RO) R511.2
NetJ118_4: J118.4 J120.4
NetJ118_6: J118.6 J120.6
NetJ118_7: J118.7 R513.1
NetJ118_8: J118.8 J120.8
NetJP13_1: JP13.1(E1) R510.2
NetLD36_2: LD36.2(A) R498.2
NetLD37_2: LD37.2(A) R500.2
NetLD38_2: LD38.2(A) R503.2

Not connected (* = marked no-connect by the designer): IC115 9(PD5_(PCINT21/OC0B/T1)) 22(PE3(ADC7/T3/MOSI1)) 23(PC0_(ADC0/PCINT8/MISO1)) 24(PC1_(ADC1/PCINT9/SCK1)); IC118 7(DIO5) 11(DIO3) 12(DIO4) 15(DIO1) 16(DIO2)

### Notes on the sheet
- firmware update data storage
- (near J118) to slave
- to master
- Project/Equipment
- Document
- Designer
- Drawn by
- Check.by
- Copyright WUT ISE 2018.
  This documentation describes Open Hardware and is licensed under the CERN OHL v.1.1. You may redistribute and modify this documentation under the terms of the CERN OHL v.1.1. (http://ohwr.org/CERNOHL). This documentation is distributed WITHOUT ANY EXPRESS OR IMPLIED WARRANTY, INCLUDING OF MERCHANTABILITY, SATISFACTORY QUALITY AND FITNESS FOR A PARTICULAR PURPOSE. Please see the CERN OHL v.1.1 for applicable conditions.
- Contact
- File
- Last Mod.
- Print Date
- Sheet
- Size
- A3
- of
- Rev
- (in symbol R0402_1K_1%_0.0625W_100PPM) 1%
- (in symbol R0402_10K_1%_0.0625W_100PPM) 1%
- (in symbol R0402_49R9_1%_0.0625W_100PPM) 1%
- (in symbol R0402_100K_1%_0.0625W_100PPM) 1%
- (in symbol SM712) 12V; 7V
- (in symbol ST485ECDR) R; D

### Library data of the parts
C334 C337 = CC0402_100NF_16V_10%_X5R: as C16#3 on sheet Sensor_Box_Water_Meter_Valve; Part Number: CC0402_100NF_16V_10%_X5R; Component Kind: Standard; Component Type: Standard; Pin Count: 2; Value: 100nF; Status: None; Manufacturer Part Number: CC0402_100NF_16V_10%_X5R; Case: 0402; Mounted: Yes; Socket: No; SMD: Yes; Sense: No; Manufacturer1 Example: MURATA; Manufacturer1 ComponentHeight: 0.55mm; HelpURL: \\cern.ch\dfs\Applications\Altium\Datasheets\CC0402_X5R_MURATA_GRM.pdf; Author: CERN DEM JLC; CreateDate: 10.12.2013; LatestRevisionDate: 10.12.2013
C335 C336 C341 = CC0402_1UF_16V_10%_X5R: as C308 on sheet Sensor_Box_Water_Meter_Valve; Part Number: CC0402_1UF_16V_10%_X5R; Component Kind: Standard; Component Type: Standard; Pin Count: 2; Value: 1uF; Status: Preferred; Manufacturer Part Number: CC0402_1UF_16V_10%_X5R; Case: 0402; Mounted: Yes; Socket: No; SMD: Yes; Sense: No; Manufacturer1 Example: TDK; Manufacturer1 ComponentHeight: 0.55mm; HelpURL: \\cern.ch\dfs\Applications\Altium\Datasheets\CC0402_X5R_TDK_C.pdf; Author: CERN DEM JLC; CreateDate: 25.10.2012; LatestRevisionDate: 25.10.2012
C339 C340 = CC0402_18PF_50V_5%_C0G: as C14#3 on sheet Sensor_Box_Water_Meter_Valve; Part Number: CC0402_18PF_50V_5%_C0G; Component Kind: Standard; Component Type: Standard; Pin Count: 2; Value: 18pF; Status: Preferred; Manufacturer Part Number: CC0402_18PF_50V_5%_C0G; Case: 0402; Mounted: Yes; Socket: No; SMD: Yes; Sense: No; Manufacturer1 Example: KEMET; Manufacturer1 ComponentHeight: 0.55mm; HelpURL: \\cern.ch\dfs\Applications\Altium\Datasheets\CC0805_C0G_KEMET_(Commercial Grade).pdf; Author: CERN DEM JLC; CreateDate: 04.10.2016; LatestRevisionDate: 04.10.2016
C342 = CC0402_100NF_16V_10%_X7R: as C315 on sheet Sensor_Box_Water_Meter_Valve; Part Number: CC0402_100NF_16V_10%_X7R; Component Kind: Standard; Component Type: Standard; Pin Count: 2; Value: 100nF; Status: Not Recommended; Manufacturer Part Number: CC0402_100NF_16V_10%_X7R; Case: 0402; Mounted: Yes; Socket: No; SMD: Yes; Manufacturer1 Example: MURATA; Manufacturer1 ComponentHeight: 0.55mm; HelpURL: \\cern.ch\dfs\Applications\Altium\Datasheets\CC0402_X7R_MURATA_GRM.pdf; Author: CERN DEM JLC; CreateDate: 05.12.2013; LatestRevisionDate: 03.12.2007; Sense: No
D140 D142 D143 = PESD3V3S1UB: as D129-D131 on sheet Sensor_Box_Water_Meter_Valve; Part Number: PESD3V3S1UB; Component Kind: Standard; Component Type: Standard; Device: PESD3V3S1UB; PackageDescription: Ultra Small Outline Diode Flat Lead (SOD-523), Body; 1.2mm L X 0.8mm W X 0.65mm H, IPC Medium Density; Manufacturer Part Number: PESD3V3S1UB; Pin Count: 2; Case: SOD523; Mounted: Yes; Socket: No; SMD: Yes; Sense: No; ComponentHeight: 0.65mm; HelpURL: \\cern.ch\dfs\Applications\Altium\Datasheets\PESD3V3S1UB.pdf; Author: CERN DEM JLC; CreateDate: 29.11.2012; LatestRevisionDate: 29.11.2012
D141 = SM712: as D132 on sheet Sensor_Box_Water_Meter_Valve; Part Number: SM712; Component Kind: Standard; Component Type: Standard; Device: SM712; PackageDescription: SOT, 0.95mm, pitch; 3 pin,1.30mm W X 2.92mm L X 1.12mm H body, IPC Medium Density; Status: Obsolete; Part Description: Asymmetrical TVS Diode for Extended Common-Mode RS-485; Manufacturer Part Number: SM712; Pin Count: 3; Case: SOT-23; Mounted: Yes; Socket: No; SMD: Yes; Sense: No; ComponentHeight: 1.12mm; HelpURL: \\cern.ch\dfs\Applications\Altium\Datasheets\SM712.pdf; Author: CERN DEM JLC; CreateDate: 23.04.2012; LatestRevisionDate: 23.04.2012
IC115 = UPC_ATMEGA328PB-MU: as IC106 on sheet Sensor_Box_Water_Meter_Valve; Part Number: ATMEGA328PB-MU; Component Kind: Standard; Component Type: Standard; Device: ATMEGA328PB-MU; PackageDescription: QFN, (MO-220-VHHD-2) 0.50mm pitch,square; 8 pin X 8 pin, 5mm X 5mm X 1.00mm H body (w/thermal tab 3.25 X 3.25mm),  IPC Medium Density; Manufacturer Part Number: ATMEGA328PB-MU; Pin Count: 33; Case: QFN32; Mounted: Yes; Socket: No; SMD: Yes; Sense: No; ComponentHeight: 1mm; HelpURL: \\cern.ch\dfs\Applications\Altium\Datasheets\ATMEGA328P-MU.pdf; Author: GK; CreateDate: 2011-02-08; LatestRevisionDate: 2014-07-02
IC116 = AP7313-33SAG-7: as IC108 on sheet Sensor_Box_Water_Meter_Valve; Part Number: AP7313-33SAG-7; Component Kind: Standard; Component Type: Standard; Device: AP7313-33SAG-7; PackageDescription: SOT23 3-Leads, Pitch 0.95mm - Body 1.3x2.9mm, IPC Medium Density; Manufacturer Part Number: AP7313-33SAG-7; Pin Count: 3; Case: SOT23; Mounted: Yes; Socket: No; SMD: Yes; Sense: No; ComponentHeight: 1.35mm; HelpURL: \\cern.ch\dfs\Applications\Altium\Datasheets\AP7313-33SAG-7.pdf; Author: CERN DEM JLC; CreateDate: 20.03.2018; LatestRevisionDate: 20.03.2018
IC117 = MEM_M24256-BRDW6P: as IC27 on sheet Sensor_Box_Water_Meter_Valve; Part Number: M24256-BRDW6P; Component Kind: Standard; Component Type: Standard; Device: M24256-BRDW6; PackageDescription: SOP, 0.65mm pitch; 8 pin, 4.40mm W X 3.00mm L X 1.20mm H body, IPC Medium Density; Part Description: 256-Kbit Serial I²C Bus EEPROM; Manufacturer Part Number: M24256-BRDW6; Pin Count: 8; Case: TSSOP8; Mounted: Yes; Socket: No; SMD: Yes; Sense: No; ComponentHeight: 1.2mm; HelpURL: \\cern.ch\dfs\Applications\Altium\Datasheets\M24256-BRDW6P.pdf; Author: CERN DEM MR; CreateDate: 17.03.2016; LatestRevisionDate: 17.03.2016
IC118 = RF_RFM95W: as IC113 on sheet Sensor_LoRa_Flower_Watchdog; Part Number: RFM95W-868S2; Component Kind: Standard; Component Type: Standard; Device: RFM95W-868S2; PackageDescription: castellated module; Manufacturer Part Number: RFM95W-868S2; Pin Count: 16; Mounted: Yes; Socket: No; SMD: Yes; Sense: No; ComponentHeight: 1.52mm; Author: GK; HelpURL: \\cern.ch\dfs\Applications\Altium\Datasheets\ERA-4XSM+.pdf; CreateDate: 11.08.2016; LatestRevisionDate: 11.08.2016
IC119 = MEM_W25X40CLSNIG: as IC114 on sheet Sensor_LoRa_Flower_Watchdog; Part Number: W25X40CLSNIG; Component Kind: Standard; Component Type: Standard; Device: W25X40CLSNIG; PackageDescription: SOIC, 8-Leads, Body 4.90x3.90mm, Pitch 1.27mm, IPC Medium Density; Part Description: 4M-bit Serial Flash Memory with uniform 4KB sectors and Dual SPI; Manufacturer Part Number: W25X40CLSNIG; Pin Count: 8; Case: SOIC8; Mounted: Yes; Socket: No; SMD: Yes; Sense: No; ComponentHeight: 2.16mm; HelpURL: \\cern.ch\dfs\Applications\Altium\Datasheets\W25Q128FVSIG.pdf; Author: GK; CreateDate: 26/01/2018; LatestRevisionDate: 26/01/2018
IC120 = ST485ECDR: as IC107 on sheet Sensor_Box_Water_Meter_Valve; Part Number: ST485ECDR; Component Kind: Standard; Component Type: Standard; Device: ST485ECDR; PackageDescription: SOIC 8, Pitch 1.27mm - Body 4x5mm, IPC Medium Density; Part Description: ±15kV ESD-Protected, Low Power  RS-485/RS-422 Transceiver; Manufacturer Part Number: ST485ECDR; Pin Count: 8; Case: SOIC8; Mounted: Yes; Socket: No; SMD: Yes; Sense: No; ComponentHeight: 1.75mm; Author: CERN DEM MR; HelpURL: \\cern.ch\dfs\Applications\Altium\Datasheets\ST485ECDR.pdf; CreateDate: 15.02.2018; LatestRevisionDate: 15.02.2018
J116 = CON_2x3 1.27 SMT Male: 1.27 mm dual row goldpin (Maritex)
J117 = HIROSE_U.FL-R-SMT-1(10): as J115 on sheet Sensor_LoRa_Flower_Watchdog; Part Number: HIROSE_U.FL-R-SMT-1(10); Component Kind: Standard; Component Type: Standard; Pin Count: 2; Family: U.FL; Mounted: Yes; Socket: No; SMD: Yes; Sense: No; Status: None; Manufacturer Part Number: U.FL-R-SMT-1(10); ComponentHeight: 1.25mm; HelpURL: \\cern.ch\dfs\Applications\Altium\Datasheets\HIROSE_U.FL-R-SMT-1(10).pdf; Author: CERN DEM JLC; CreateDate: 24/03/2010; LatestRevisionDate: 24/03/2010
J118 = EDGE10T5B10_P200W1000L0F100X400: as J110 on sheet Sensor_Box_Water_Meter_Valve; Part Number: EDGE10T5B10_P200W1000L0F100X400; Component Kind: Standard (No BOM); Component Type: Standard (No BOM); Pin Count: 10; Socket: No; SMD: No; Sense: No; Status: None; ComponentHeight: 0mm; HelpURL: \\cern.ch\dfs\Applications\Altium\Datasheets\EDGE10T5B10_P200W1000L0F100X400.pdf; Author: CERN DEM MR; CreateDate: 14.02.2018; LatestRevisionDate: 14.02.2018
J119 = AVX_00 9159 010 061 916: as J111 on sheet Sensor_Box_Water_Meter_Valve; Part Number: AVX_00 9159 010 061 916; Component Kind: Standard; Component Type: Standard; Pin Count: 10; Mounted: Yes; Socket: No; SMD: No; Sense: No; Status: None; Manufacturer Part Number: 00 9159 010 061 916; ComponentHeight: 1.6mm; HelpURL: \\cern.ch\dfs\Applications\Altium\Datasheets\AVX_00 9159 010 061 916.pdf; Author: CERN DEM MR; CreateDate: 13.02.2018; LatestRevisionDate: 13.02.2018
J120 = EDGE10T1B6_P200W1000L0F100X400: as J112 on sheet Sensor_Box_Water_Meter_Valve; Part Number: EDGE10T1B6_P200W1000L0F100X400; Component Kind: Standard (No BOM); Component Type: Standard (No BOM); Pin Count: 10; Socket: No; SMD: No; Sense: No; Status: None; ComponentHeight: 0mm; HelpURL: \\cern.ch\dfs\Applications\Altium\Datasheets\EDGE10T1B6_P200W1000L0F100X400.pdf; Author: CERN DEM MR; CreateDate: 14.02.2018; LatestRevisionDate: 14.02.2018
JP13 = JUMPER: Supplier 1: Farnell; Supplier Part Number 1: 1798942
LD36 LD37 = LED_KINGBRIGHT_KPTR-3216CGCK: LED Green 1A 2C; Part Description: Reverse Mount LED 1.4x1.6mm Green; PressFit: No; Bonding: No; Part Number: LED_KINGBRIGHT_KPTR-3216CGCK; Component Kind: Standard; Component Type: Standard; Color: Green; PackageDescription: Reverse Mount LED 3216, Hole 2.1x2.3mm 0.35mm Height; Manufacturer: KINGBRIGHT; Manufacturer Part Number: KPTR-3216CGCK; Pin Count: 2; Mounted: Yes; Socket: No; SMD: Yes; Sense: No; ComponentHeight: 0.35mm; HelpURL: \\cern.ch\dfs\Applications\Altium\Datasheets\LED_KINGBRIGHT_KPTR-3216CGCK.pdf; Author: CERN DEM MR; CreateDate: 15.02.2016; LatestRevisionDate: 15.02.2016
LD38 = LED_KINGBRIGHT_KPH-1608CGCK: as LD34 on sheet Sensor_Box_Water_Meter_Valve; Part Number: LED_KINGBRIGHT_KPH-1608CGCK; Component Kind: Standard; Component Type: Standard; Color: Green; PackageDescription: SMT Green LED, Case 0603, Body L 1.6 x W 0.8mm H 0.65mm; Manufacturer: KINGBRIGHT; Manufacturer Part Number: KPH-1608CGCK; Pin Count: 2; Mounted: Yes; Socket: No; SMD: Yes; Sense: No; ComponentHeight: 0.65mm; HelpURL: \\cern.ch\dfs\Applications\Altium\Datasheets\LED_KINGBRIGHT_KPH-1608CGCK.pdf; Author: CERN DEM JLC; CreateDate: 03.07.2017; LatestRevisionDate: 03.07.2017
Q13 = XTAL_8.192MHZ_ABRACON_ABLS-8.192MHZ-B2-T: as Q1#3 on sheet Sensor_Box_Water_Meter_Valve; Part Number: XTAL_8.192MHZ_ABRACON_ABLS-8.192MHZ-B2-T; Component Kind: Standard; Component Type: Standard; PackageDescription: SMD Crystal, Body 11.40mm L X 4.70mm W X 4.20mm H, HC/49US (AT49) ALBS Series; Value: 8.192MHz; Manufacturer: ABRACON; Manufacturer Part Number: ABLS-8.192MHZ-B2-T; Pin Count: 2; Mounted: Yes; Socket: No; SMD: Yes; Sense: No; ComponentHeight: 4.2mm; HelpURL: \\cern.ch\dfs\Applications\Altium\Datasheets\XTAL_ABRACON_ABLS.pdf; Author: CERN DEM MR; CreateDate: 15.02.2018; LatestRevisionDate: 15.02.2018
R498-R501 R503 R505 R506 R508 R509 = R0402_10K_1%_0.0625W_100PPM: as R116 on sheet Sensor_Box_Water_Meter_Valve; Part Number: R0402_10K_1%_0.0625W_100PPM; Component Kind: Standard; Component Type: Standard; Pin Count: 2; Value: 10k; Status: Not Recommended; Power: 0.0625W; Tolerance: ±1%; Manufacturer Part Number: R0402_10K_1%_0.0625W_100PPM; Case: 0402; Mounted: Yes; Sense: No; Socket: No; SMD: Yes; Manufacturer1 Example: YAGEO PHYCOMP; Manufacturer1 ComponentHeight: 0.4mm; HelpURL: \\cern.ch\dfs\Applications\Altium\Datasheets\R0402_Phycomp_RC0402.pdf; Author: CERN DEM JLC; CreateDate: 03.12.2007; LatestRevisionDate: 17.10.2012
R502 R512 = R0402_100K_1%_0.0625W_100PPM: as R17#3 on sheet Sensor_Box_Water_Meter_Valve; Part Number: R0402_100K_1%_0.0625W_100PPM; Component Kind: Standard; Component Type: Standard; Pin Count: 2; Value: 100k; Status: Not Recommended; Power: 0.0625W; Tolerance: ±1%; Manufacturer Part Number: R0402_100K_1%_0.0625W_100PPM; Case: 0402; Mounted: Yes; Sense: No; Socket: No; SMD: Yes; Manufacturer1 Example: YAGEO PHYCOMP; Manufacturer1 ComponentHeight: 0.4mm; HelpURL: \\cern.ch\dfs\Applications\Altium\Datasheets\R0402_Phycomp_RC0402.pdf; Author: CERN DEM JLC
  R502: CreateDate: 03/12/2007; LatestRevisionDate: 17/10/2012
  R512: CreateDate: 03.12.2007; LatestRevisionDate: 17.10.2012
R510 = RES_1206: SMD Resistor; Supplier 1: Newark; Supplier Part Number 1: 39K0871
R511 = R0402_1K_1%_0.0625W_100PPM: as R15#4 on sheet Sensor_Box_Water_Meter_Valve; Part Number: R0402_1K_1%_0.0625W_100PPM; Component Kind: Standard; Component Type: Standard; Pin Count: 2; Value: 1k; Status: Not Recommended; Power: 0.0625W; Tolerance: ±1%; Manufacturer Part Number: R0402_1K_1%_0.0625W_100PPM; Case: 0402; Mounted: Yes; Sense: No; Socket: No; SMD: Yes; Manufacturer1 Example: YAGEO PHYCOMP; Manufacturer1 ComponentHeight: 0.4mm; HelpURL: \\cern.ch\dfs\Applications\Altium\Datasheets\R0402_Phycomp_RC0402.pdf; Author: CERN DEM JLC; CreateDate: 03.12.2007; LatestRevisionDate: 17.10.2012
R513 R514 = R0402_49R9_1%_0.0625W_100PPM: as R451 on sheet Sensor_Box_Water_Meter_Valve; Part Number: R0402_49R9_1%_0.0625W_100PPM; Component Kind: Standard; Component Type: Standard; Pin Count: 2; Value: 49R9; Status: Not recommended; Power: 0.0625W; Tolerance: ±1%; Manufacturer Part Number: R0402_49R9_1%_0.0625W_100PPM; Case: 0402; Mounted: Yes; Socket: No; SMD: Yes; Manufacturer1 Example: YAGEO PHYCOMP; Manufacturer1 ComponentHeight: 0.4mm; HelpURL: \\cern.ch\dfs\Applications\Altium\Datasheets\R0402_Phycomp_RC0402.pdf; Author: CERN DEM JLC; CreateDate: 2012-10-24; LatestRevisionDate: 2012-10-24
R515 = R0402_10K_1%_0.0625W_100PPM: as R458 on sheet Sensor_Box_Water_Meter_Valve; Part Number: R0402_10K_1%_0.0625W_100PPM; Component Kind: Standard; Component Type: Standard; Pin Count: 2; Value: 10k; Status: Not recommended; Power: 0.0625W; Tolerance: ±1%; Manufacturer Part Number: R0402_10K_1%_0.0625W_100PPM; Case: 0402; Mounted: Yes; Socket: No; SMD: Yes; Manufacturer1 Example: YAGEO PHYCOMP; Manufacturer1 ComponentHeight: 0.4mm; HelpURL: \\cern.ch\dfs\Applications\Altium\Datasheets\R0402_Phycomp_RC0402.pdf; Author: CERN DEM JLC; CreateDate: 2007-12-03; LatestRevisionDate: 2012-10-17
T42 T43 = BSS138LT1G: as T34 on sheet Sensor_Box_Water_Meter_Valve; Part Number: BSS138LT1G; Component Kind: Standard; Component Type: Standard; Device: BSS138LT1G; PackageDescription: SOT23 3-Leads, Pitch 0.95mm - Body 1.4x3mm, IPC Medium Density; Manufacturer Part Number: BSS138LT1G; Pin Count: 3; Case: SOT23-3; Mounted: Yes; Socket: No; SMD: Yes; Sense: No; ComponentHeight: 1.11mm; HelpURL: \\cern.ch\dfs\Applications\Altium\Datasheets\BSS138LT1G.pdf; Author: CERN DEM JLC; CreateDate: 23.03.2009; LatestRevisionDate: 23.03.2009
TP57 TP58 = SMD_PAD_1.27X1.27MM: as TP53-TP56 on sheet Sensor_LoRa_Flower_Watchdog; Part Number: SMD_PAD_1.27X1.27MM; Component Kind: Standard (No BOM); Component Type: Standard (No BOM); Pin Count: 1; Family: Test Point; Socket: No; SMD: Yes; Sense: No; Status: None; ComponentHeight: 0mm; HelpURL: Undefined; Author: CERN DEM JLC; CreateDate: 12.01.2008; LatestRevisionDate: 12.01.2008; PackageDescription: 1.27mm x 1.27mm PCB Copper Area (SMD Test Point)